# EAGLE design Io (EAGLE 6.0)
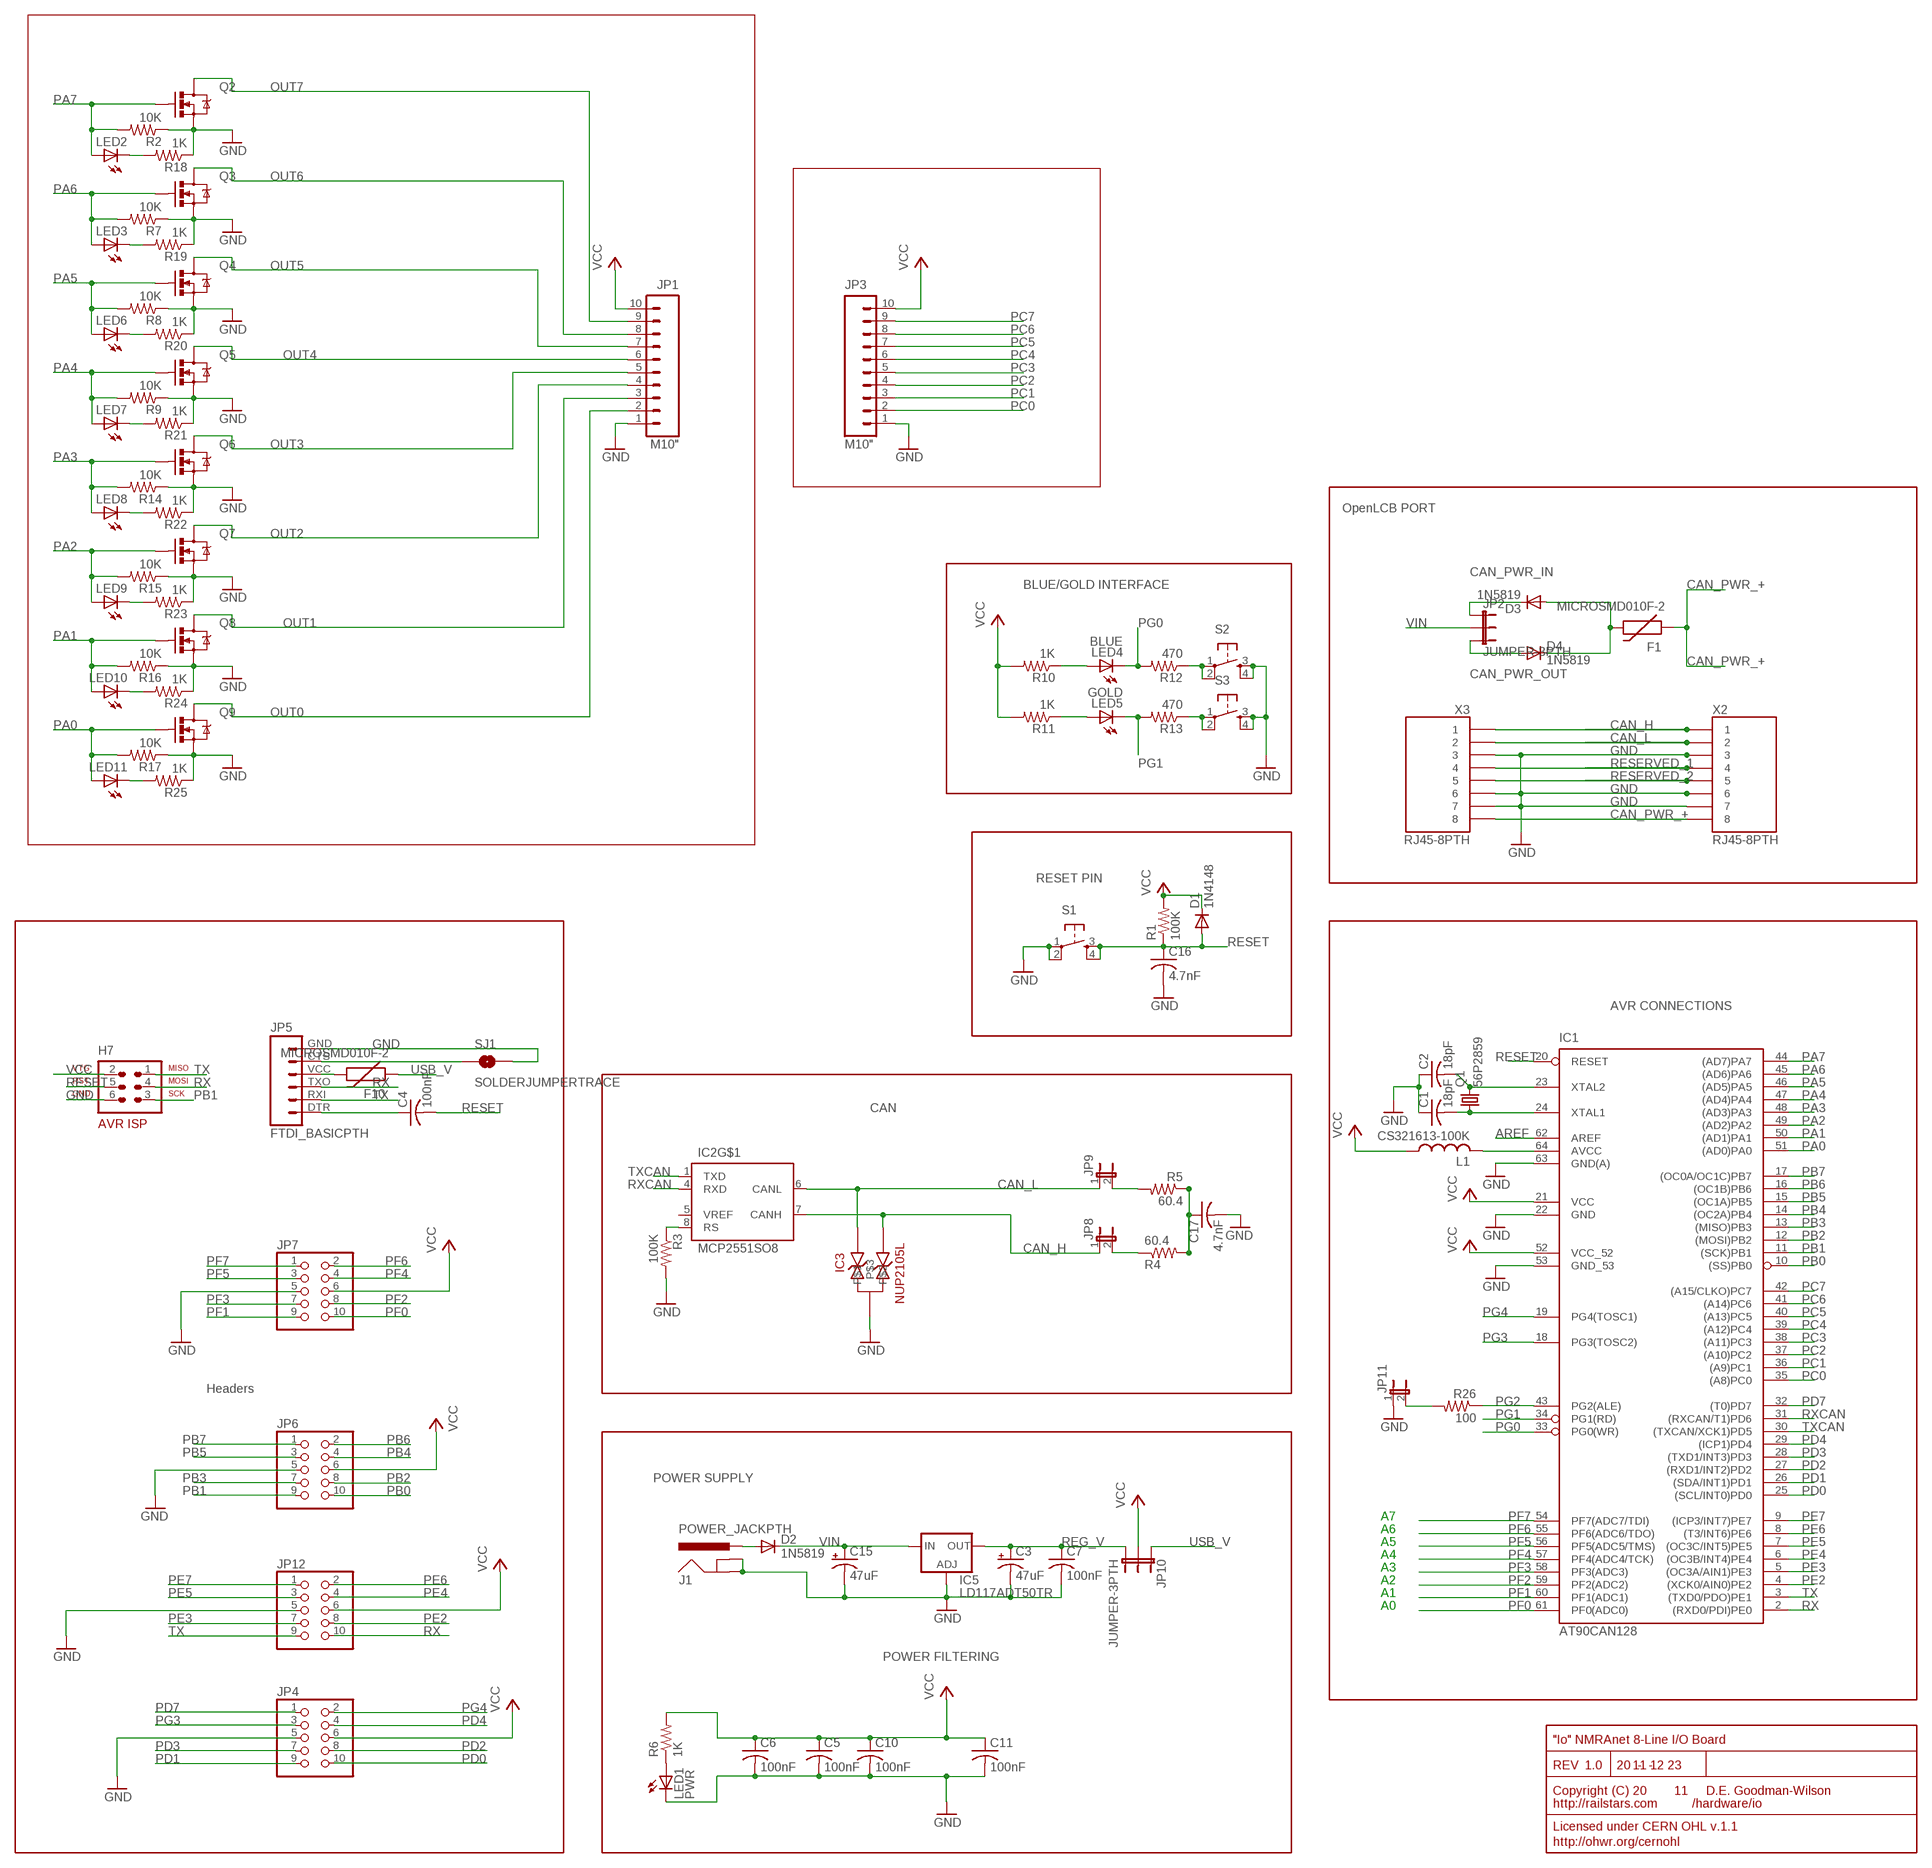
[diagram p0: schematic, sheet 1]

## Parts
C1  18pF  C-USC1206  [C1206]
C2  18pF  C-USC1206  [C1206]
C3  47uF  CPOL-USUD-6,3X5,8  [UD-6,3X5,8_NICHICON]
C4  100nF  C-USC1206  [C1206]
C5  100nF  C-USC1206  [C1206]
C6  100nF  C-USC1206  [C1206]
C7  100nF  C-USC1206  [C1206]
C10  100nF  C-USC1206  [C1206]
C11  100nF  C-USC1206  [C1206]
C15  47uF  CPOL-USUD-6,3X5,8  [UD-6,3X5,8_NICHICON]
C16  4.7nF  C-USC1206  [C1206]
C17  4.7nF  C-USC1206  [C1206]
D1  1N4148  DIODE-SOD123  [SOD123]
D2  1N5819  DIODESMA  [SMA-DIODE]
D3  1N5819  DIODESMA  [SMA-DIODE]
D4  1N5819  DIODESMA  [SMA-DIODE]
F1  MICROSMD010F-2  PTCSMD  [PTC-1206]
F10  MICROSMD010F-2  PTCSMD  [PTC-1206]
H7  ICSP  AVR-ISP-6  [AVR-ISP-6]
IC1  AT90CAN128  [TQFP64]
IC2  MCP2551SO8  [SO08]
IC3  NUP2105L  [SOT-23]
IC5  LD117ADT50TR  [DPACK]
J1  POWER_JACKPTH  [POWER_JACK_PTH]
JP1  M10"  [1X10]
JP2  JUMPER-3PTH  [1X03]
JP3  M10"  [1X10]
JP4  2X5_HEADERSHROUDED  [2X5_SHROUD]
JP5  FTDI_BASICPTH  [FTDI_BASIC]
JP6  2X5_HEADERSHROUDED  [2X5_SHROUD]
JP7  2X5_HEADERSHROUDED  [2X5_SHROUD]
JP8  JUMPER-2PTH  [1X02]
JP9  JUMPER-2PTH  [1X02]
JP10  JUMPER-3PTH  [1X03]
JP11  JUMPER-2PTH  [1X02]
JP12  2X5_HEADERSHROUDED  [2X5_SHROUD]
L1  CS321613-100K  L-USL3216C  [L3216C]
LED1  PWR  LEDCHIPLED_1206  [CHIPLED_1206]
LED2  LEDCHIPLED_1206  [CHIPLED_1206]
LED3  LEDCHIPLED_1206  [CHIPLED_1206]
LED4  BLUE  LEDCHIPLED_1206  [CHIPLED_1206]
LED5  GOLD  LEDCHIPLED_1206  [CHIPLED_1206]
LED6  LEDCHIPLED_1206  [CHIPLED_1206]
LED7  LEDCHIPLED_1206  [CHIPLED_1206]
LED8  LEDCHIPLED_1206  [CHIPLED_1206]
LED9  LEDCHIPLED_1206  [CHIPLED_1206]
LED10  LEDCHIPLED_1206  [CHIPLED_1206]
LED11  LEDCHIPLED_1206  [CHIPLED_1206]
Q1  56P2859  CRYSTALHC49S  [HC49/S]
Q2  PMV56XN  MOSFET-NCHANNELSMD  [SOT23-3]
Q3  PMV56XN  MOSFET-NCHANNELSMD  [SOT23-3]
Q4  PMV56XN  MOSFET-NCHANNELSMD  [SOT23-3]
Q5  PMV56XN  MOSFET-NCHANNELSMD  [SOT23-3]
Q6  PMV56XN  MOSFET-NCHANNELSMD  [SOT23-3]
Q7  PMV56XN  MOSFET-NCHANNELSMD  [SOT23-3]
Q8  PMV56XN  MOSFET-NCHANNELSMD  [SOT23-3]
Q9  PMV56XN  MOSFET-NCHANNELSMD  [SOT23-3]
R1  100K  R-US_R1206  [R1206]
R2  10K  R-US_R1206  [R1206]
R3  100K  R-US_R1206  [R1206]
R4  60.4  R-US_R1206  [R1206]
R5  60.4  R-US_R1206  [R1206]
R6  1K  R-US_R1206  [R1206]
R7  10K  R-US_R1206  [R1206]
R8  10K  R-US_R1206  [R1206]
R9  10K  R-US_R1206  [R1206]
R10  1K  R-US_R1206  [R1206]
R11  1K  R-US_R1206  [R1206]
R12  470  R-US_R1206  [R1206]
R13  470  R-US_R1206  [R1206]
R14  10K  R-US_R1206  [R1206]
R15  10K  R-US_R1206  [R1206]
R16  10K  R-US_R1206  [R1206]
R17  10K  R-US_R1206  [R1206]
R18  1K  R-US_R1206  [R1206]
R19  1K  R-US_R1206  [R1206]
R20  1K  R-US_R1206  [R1206]
R21  1K  R-US_R1206  [R1206]
R22  1K  R-US_R1206  [R1206]
R23  1K  R-US_R1206  [R1206]
R24  1K  R-US_R1206  [R1206]
R25  1K  R-US_R1206  [R1206]
R26  100  R-US_R1206  [R1206]
S1  TAC_SWITCHPTH  [TACTILE-PTH]
S2  TAC_SWITCHPTH  [TACTILE-PTH]
S3  TAC_SWITCHPTH  [TACTILE-PTH]
SJ1  SOLDERJUMPERTRACE  [SJ_2S-TRACE]
U$14  RAILSTARS_LOGO50MM  [RAILSTARS_50MM]
X2  RJ45-8PTH  [RJ45-8]
X3  RJ45-8PTH  [RJ45-8]

## Nets
AREF: IC1.62(AREF)
CAN_H: IC2.7(CANH) IC3.2 JP8.1 X2.1 X3.1
CAN_L: IC2.6(CANL) IC3.1 JP9.1 X2.2 X3.2
CAN_PWR_+: F1.1 X2.8 X3.8
CAN_PWR_IN: D3.C JP2.1
CAN_PWR_OUT: D4.A JP2.3
GND [gnd]: C1.1 C2.1 C3.- C5.2 C6.2 C7.2 C10.2 C11.2 C15.- C16.2 C17.2 H7.6 IC1.22(GND) IC1.53(GND_53) IC1.63(GND(A)) IC3.3 IC5.1(ADJ) J1.GND J1.GNDBREAK JP1.1 JP3.1 JP4.5 JP5.GND JP6.5 JP7.5 JP11.1 JP12.5 LED1.C Q2.2(S) Q3.2(S) Q4.2(S) Q5.2(S) Q6.2(S) Q7.2(S) Q8.2(S) Q9.2(S) R2.1 R3.2 R7.1 R8.1 R9.1 R14.1 R15.1 R16.1 R17.1 R18.1 R19.1 R20.1 R21.1 R22.1 R23.1 R24.1 R25.1 S1.1 S1.2 S2.3 S2.4 S3.3 S3.4 SJ1.2 X2.3 X2.6 X2.7 X3.3 X3.6 X3.7
N$1: C17.1 R4.2 R5.1
N$2: JP8.2 R4.1
N$3: LED4.A R10.1
N$4: JP9.2 R5.2
N$5: LED5.A R11.1
N$6: IC2.8(RS) R3.1
N$7: R12.1 S2.1 S2.2
N$8: F10.2 JP5.VCC
N$9: LED1.A R6.1
N$10: D2.A J1.PWR
N$11: C1.2 IC1.24(XTAL1) Q1.1
N$12: R13.1 S3.1 S3.2
N$13: LED10.C R24.2
N$14: LED9.C R23.2
N$15: LED8.C R22.2
N$16: D3.A D4.C F1.2
N$17: LED7.C R21.2
N$18: LED6.C R20.2
N$19: LED3.C R19.2
N$20: LED2.C R18.2
N$21: LED11.C R25.2
N$22: IC1.64(AVCC) L1.2
N$23 [gnd]: JP5.CTS SJ1.1
N$25: JP11.2 R26.2
N$35: C4.1 JP5.DTR
OUT0: JP1.2 Q9.3(D)
OUT1: JP1.3 Q8.3(D)
OUT2: JP1.4 Q7.3(D)
OUT3: JP1.5 Q6.3(D)
OUT4: JP1.6 Q5.3(D)
OUT5: JP1.7 Q4.3(D)
OUT6: JP1.8 Q3.3(D)
OUT7: JP1.9 Q2.3(D)
PA0: IC1.51((AD0)PA0) LED11.A Q9.1(G) R17.2
PA1: IC1.50((AD1)PA1) LED10.A Q8.1(G) R16.2
PA2: IC1.49((AD2)PA2) LED9.A Q7.1(G) R15.2
PA3: IC1.48((AD3)PA3) LED8.A Q6.1(G) R14.2
PA4: IC1.47((AD4)PA4) LED7.A Q5.1(G) R9.2
PA5: IC1.46((AD5)PA5) LED6.A Q4.1(G) R8.2
PA6: IC1.45((AD6)PA6) LED3.A Q3.1(G) R7.2
PA7: IC1.44((AD7)PA7) LED2.A Q2.1(G) R2.2
PB0: IC1.10((SS)PB0) JP6.10
PB1: H7.3 IC1.11((SCK)PB1) JP6.9
PB2: IC1.12((MOSI)PB2) JP6.8
PB3: IC1.13((MISO)PB3) JP6.7
PB4: IC1.14((OC2A)PB4) JP6.4
PB5: IC1.15((OC1A)PB5) JP6.3
PB6: IC1.16((OC1B)PB6) JP6.2
PB7: IC1.17((OC0A/OC1C)PB7) JP6.1
PC0: IC1.35((A8)PC0) JP3.2
PC1: IC1.36((A9)PC1) JP3.3
PC2: IC1.37((A10)PC2) JP3.4
PC3: IC1.38((A11)PC3) JP3.5
PC4: IC1.39((A12)PC4) JP3.6
PC5: IC1.40((A13)PC5) JP3.7
PC6: IC1.41((A14)PC6) JP3.8
PC7: IC1.42((A15/CLKO)PC7) JP3.9
PD0: IC1.25((SCL/INT0)PD0) JP4.10
PD1: IC1.26((SDA/INT1)PD1) JP4.9
PD2: IC1.27((RXD1/INT2)PD2) JP4.8
PD3: IC1.28((TXD1/INT3)PD3) JP4.7
PD4: IC1.29((ICP1)PD4) JP4.4
PD7: IC1.32((T0)PD7) JP4.1
PE2: IC1.4((XCK0/AIN0)PE2) JP12.8
PE3: IC1.5((OC3A/AIN1)PE3) JP12.7
PE4: IC1.6((OC3B/INT4)PE4) JP12.4
PE5: IC1.7((OC3C/INT5)PE5) JP12.3
PE6: IC1.8((T3/INT6)PE6) JP12.2
PE7: IC1.9((ICP3/INT7)PE7) JP12.1
PF0: IC1.61(PF0(ADC0)) JP7.10
PF1: IC1.60(PF1(ADC1)) JP7.9
PF2: IC1.59(PF2(ADC2)) JP7.8
PF3: IC1.58(PF3(ADC3)) JP7.7
PF4: IC1.57(PF4(ADC4/TCK)) JP7.4
PF5: IC1.56(PF5(ADC5/TMS)) JP7.3
PF6: IC1.55(PF6(ADC6/TDO)) JP7.2
PF7: IC1.54(PF7(ADC7/TDI)) JP7.1
PG0: IC1.33(PG0(WR)) LED4.C R12.2
PG1: IC1.34(PG1(RD)) LED5.C R13.2
PG2: IC1.43(PG2(ALE)) R26.1
PG3: IC1.18(PG3(TOSC2)) JP4.3
PG4: IC1.19(PG4(TOSC1)) JP4.2
REG_V: C3.+ C7.1 IC5.4(OUT) JP10.3
RESERVED_1: X2.4 X3.4
RESERVED_2: X2.5 X3.5
RESET: C4.2 C16.1 D1.A H7.5 IC1.20(RESET) R1.1 S1.3 S1.4
RX: H7.4 IC1.2((RXD0/PDI)PE0) JP5.TXO JP12.10
RXCAN: IC1.31((RXCAN/T1)PD6) IC2.4(RXD)
TX: H7.1 IC1.3((TXD0/PDO)PE1) JP5.RXI JP12.9
TXCAN: IC1.30((TXCAN/XCK1)PD5) IC2.1(TXD)
USB_V: F10.1 JP10.1
VCC: C5.1 C6.1 C10.1 C11.1 D1.C H7.2 IC1.21(VCC) IC1.52(VCC_52) JP1.10 JP3.10 JP4.6 JP6.6 JP7.6 JP10.2 JP12.6 L1.1 R1.2 R6.2 R10.2 R11.2
VIN: C15.+ D2.C IC5.3(IN) JP2.2
XTAL1: C2.2 IC1.23(XTAL2) Q1.2
Unconnected: IC2.5(VREF)

## Notes on the sheet
- OpenLCB PORT
- BLUE/GOLD INTERFACE
- RESET PIN
- AVR CONNECTIONS
- CAN
- Headers
- POWER SUPPLY
- A7
- A6
- A5
- A4
- A3
- A2
- A1
- A0
- POWER FILTERING
- "Io" NMRAnet 8-Line I/O Board
- 1.0 | 11 12 23
- 11
- /hardware/io
- Licensed under CERN OHL v.1.1
- http://ohwr.org/cernohl

## Power pins joined to a net without a drawn wire
GND: IC2.2(GND)
VCC: IC2.3(VCC)

## Library data of the parts
C1 C2 C4-C7 C10 C11 C16 C17 = rcl:C-US: CAPACITOR, American symbol
C3 C15 = rcl:CPOL-US: POLARIZED CAPACITOR, American symbol
D1 = diode:DIODE-: DIODE
D2-D4 = SparkFun:DIODE: Diode These are standard reverse protection diodes and small signal diodes. SMA package can handle up to about 1A. SOD-323 can handle about 200mA. What the SOD-323 package when ordering, there are some mfgs out there that are 5-pin packages.
F1 F10 = SparkFun:PTC: Resettable Fuse PTC Resettable Fuse. Spark Fun Electronics SKU : COM-08357
H7 = avr-4:AVR-ISP-6: AVR ISP-6 Serial Programming Header
IC1 = at90can128:AT90CAN128
IC2 = can:MCP2551: CAN Tranceiver Microchip
IC3 = Artificial Science:NUP2105L
IC5 = v-reg:LD117A?*: Low drop fixed and adjustable positive voltage regulators 1 A Source: http://www.st.com/stonline/products/literature/ds/7194/ld1117axx.pdf
J1 = SparkFun:POWER_JACK: Power Jack This is the standard 5.5mm barrel jack for power. The PTH is the most common, proven, reliable, footprint. All others are experimental. The Slot footprint only works if the mill layer is transmitted to the PCB fab house so be warned. Spark Fun Electronics SKU : PRT-00119. Mating wall wart : TOL-00298 (and others)
JP1 JP3 = SparkFun:M10: Header 10 Standard 10-pin 0.1" header. Use with straight break away headers (SKU : PRT-00116), right angle break away headers (PRT-00553), swiss pins (PRT-00743), machine pins (PRT-00117), and female headers (PRT-00115).
JP2 JP10 = SparkFun:JUMPER-3
JP4 JP6 JP7 JP12 = Railstars:2X5_HEADER
JP5 = SparkFun:FTDI_BASIC: FTDI Basic: 3.3V and 5V
JP8 JP9 JP11 = SparkFun:JUMPER-2: Jumper Basic 0.1" spaced jumper. Use with breakaway headers.
L1 = rcl:L-US: INDUCTOR, American symbol
LED1-LED11 = led:LED: LED OSRAM: - CHIPLED LG R971, LG N971, LY N971, LG Q971, LY Q971, LO R971, LY R971 LH N974, LH R974 LS Q976, LO Q976, LY Q976 LO Q996 - Hyper CHIPLED LW Q18S LB Q993, LB Q99A, LB R99A - SideLED LS A670, LO A670, LY A670, LG A670, LP A670 LB A673, LV A673, LT A673, LW A673 LH A674 LY A675 LS A676, LA A676, LO A676, LY A676, LW A676 LS A679, LY A679, LG A679 - Hyper Micro SIDELED® LS Y876, LA Y876, LO Y876, LY Y876 LT Y87S - SmartLED LW L88C, LW L88S LB L89C, LB L89S, LG L890 LS L89K, LO L89K, LY L89K LS L896, LA L896, LO L896, LY L896 - TOPLED LS T670, LO T670, LY T670, LG T670, LP T670 LSG T670, LSP T670, LSY T670, LOP T670, LYG T670 LG T671, LOG T671, LSG T671 LB T673, LV T673, LT T673, LW T673 LH T674 LS T676, LA T676, LO T676, LY T676, LB T676, LH T676, LSB T676, LW T676 LB T67C, LV T67C, LT T67C, LS T67K, LO T67K, LY T67K, LW E67C LS E67B, LA E67B, LO E67B, LY E67B, LB E67C, LV E67C, LT E67C LW T67C LS T679, LY T679, LG T679 LS T770, LO T770, LY T770, LG T770, LP T770 LB T773, LV T773, LT T773, LW T773 LH T774 LS E675, LA E675, LY E675, LS T675 LS T776, LA T776, LO T776, LY T776, LB T776 LHGB T686 LT T68C, LB T68C - Hyper Mini TOPLED® LB M676 - Mini TOPLED Santana® LG M470 LS M47K, LO M47K, LY M47K Source: http://www.osram.convergy.de LUXEON: - LUMILED® LXK2-PW12-R00, LXK2-PW12-S00, LXK2-PW14-U00, LXK2-PW14-V00 LXK2-PM12-R00, LXK2-PM12-S00, LXK2-PM14-U00 LXK2-PE12-Q00, LXK2-PE12-R00, LXK2-PE12-S00, LXK2-PE14-T00, LXK2-PE14-U00 LXK2-PB12-K00, LXK2-PB12-L00, LXK2-PB12-M00, LXK2-PB14-N00, LXK2-PB14-P00, LXK2-PB14-Q00 LXK2-PR12-L00, LXK2-PR12-M00, LXK2-PR14-Q00, LXK2-PR14-R00 LXK2-PD12-Q00, LXK2-PD12-R00, LXK2-PD12-S00 LXK2-PH12-R00, LXK2-PH12-S00 LXK2-PL12-P00, LXK2-PL12-Q00, LXK2-PL12-R00 Source: www.luxeon.com KINGBRIGHT: KA-3528ASYC Source: www.kingbright.com
Q1 = crystal:CRYSTAL: CRYSTAL; OC_FARNELL: 1667008; OC_NEWARK: unknown
Q2-Q9 = SparkFun:MOSFET-NCHANNEL
R1-R26 = rcl:R-US_: RESISTOR, American symbol
S1-S3 = SparkFun:TAC_SWITCH: Momentary Switch Button commonly used for reset or general input. Spark Fun Electronics SKU : COM-00097
SJ1 = SparkFun:SOLDERJUMPER: Solder Jumper Standard SMD solder jumper. Used to automate production. Two varients : Normally Open and Normally Closed are the same, but have different paste layers. NC will have a large amount of paste and should jumper during reflow.
U$14 = Artificial Science:RAILSTARS_LOGO
X2 X3 = SparkFun:RJ45-8: RJ45 Jack Simple RJ45, 8-pin connection - connector for common Cat5, Cat5e, and Cat6 Ethernet cables. Footprint not yet proven in production. Connector sku is PRT-00643; Breakout PCB sku is BOB-00716.

## Net classes
0 default: width 0.254 mm, drill 0.305 mm, clearance 0.152 mm
2 gnd: width 0.305 mm, drill 0.508 mm, clearance 0.152 mm
3 usbvcc: width 0.508 mm, drill 0.508 mm, clearance 0.152 mm

## Board
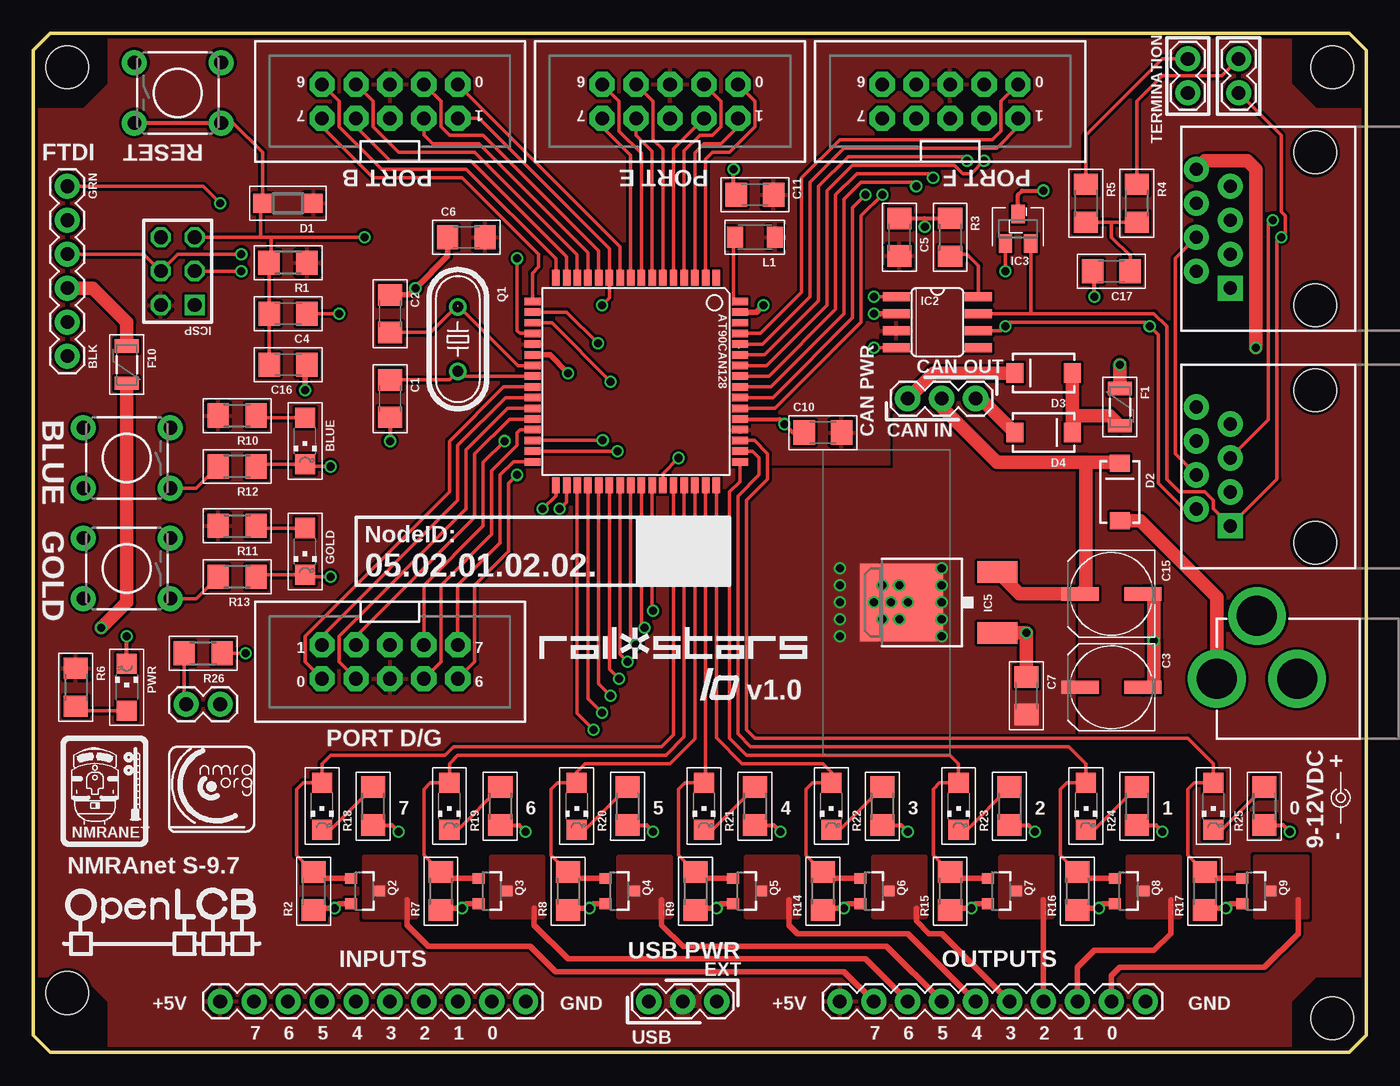
[diagram p1: board, top side]
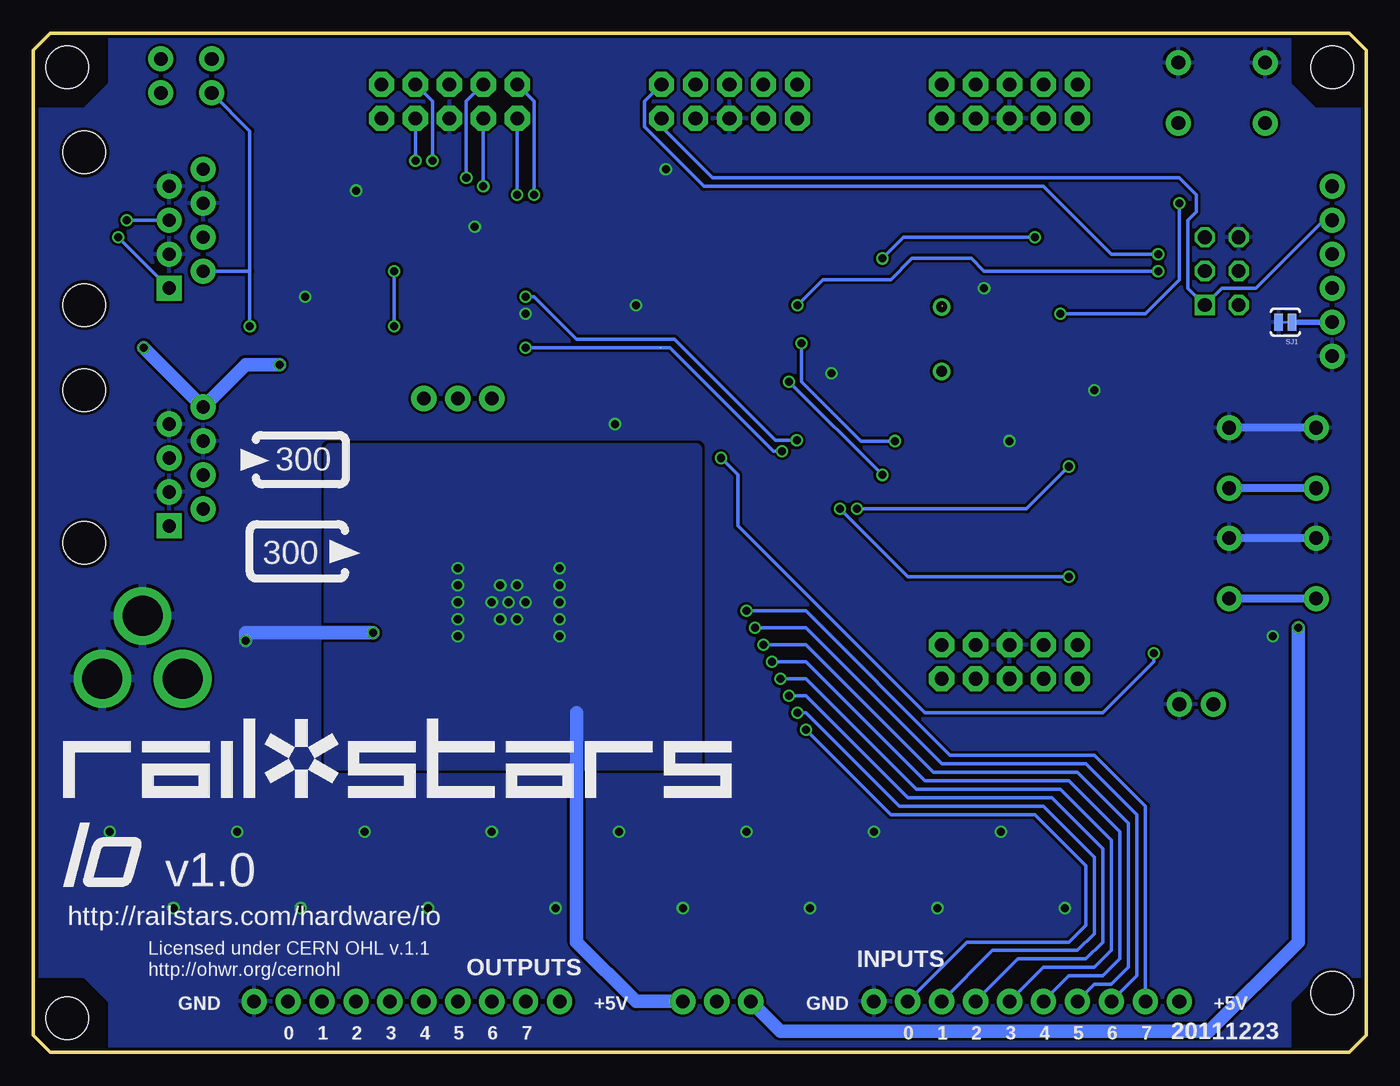
[diagram p2: board, bottom side, seen from below]

Size 99.69 x 76.2 mm. Coordinates in mm from the lower left corner, seen from the top.
Outline: 99.69,1.27 98.42,0 1.27,0 0,1.27 0,74.93 1.27,76.2 98.42,76.2 99.69,74.93 99.69,1.27
Copper layers (1*16): Top 0.035mm / dielectric 1.5mm / Bottom 0.035mm
Design rules: minimum track width 8mil, minimum drill 12mil, track to track 8mil, track to pad 8mil, pad to pad 8mil, via to via 8mil, smd to smd 0mil, copper to edge 10mil, drill to drill 10mil, minimum pad ring 10mil, minimum via ring 6mil, stop-mask expansion 2mil, vias tented up to drill 100mil, thermal gap 10mil
Holes 3.2 mm at 97.16,2.54 97.16,73.66 2.54,73.66 2.54,4.45

### Footprints (pad centres in the part's own frame; a part is rotated, then mirrored left to right if it is on the bottom)
C1206 = smd 1.6 x 1.8: 1 -1.4,0; 2 1.4,0
UD-6,3X5,8_NICHICON = smd 2.8 x 1: + 2.35,0; - -2.35,0
SOD123 = smd 1.4 x 1.4: A 1.9,0; C -1.9,0
SMA-DIODE = smd 1.27 x 1.47: A -2.15,0; C 2.15,0
PTC-1206 = smd 1 x 1.8: 1 -1.4,0; 2 1.4,0
AVR-ISP-6 = drill 1.016 square: 1 -2.54,-1.27 | drill 1.016 octagon: 2 -2.54,1.27; 3 0,-1.27; 4 0,1.27; 5 2.54,-1.27; 6 2.54,1.27
TQFP64 = smd 1.194 x 0.559: 1 -7.76,6; 2 -7.76,5.2; 3 -7.76,4.4; 4 -7.76,3.6; 5 -7.76,2.8; 6 -7.76,2; 7 -7.76,1.2; 8 -7.76,0.4; 9 -7.76,-0.4; 10 -7.76,-1.2; 11 -7.76,-2; 12 -7.76,-2.8; 13 -7.76,-3.6; 14 -7.76,-4.4; 15 -7.76,-5.2; 16 -7.76,-6; 33 7.76,-6; 34 7.76,-5.2; 35 7.76,-4.4; 36 7.76,-3.6; 37 7.76,-2.8; 38 7.76,-2; 39 7.76,-1.2; 40 7.76,-0.4; 41 7.76,0.4; 42 7.76,1.2; 43 7.76,2; 44 7.76,2.8; 45 7.76,3.6; 46 7.76,4.4; 47 7.76,5.2; 48 7.76,6 | smd 0.559 x 1.194: 17 -6,-7.76; 18 -5.2,-7.76; 19 -4.4,-7.76; 20 -3.6,-7.76; 21 -2.8,-7.76; 22 -2,-7.76; 23 -1.2,-7.76; 24 -0.4,-7.76; 25 0.4,-7.76; 26 1.2,-7.76; 27 2,-7.76; 28 2.8,-7.76; 29 3.6,-7.76; 30 4.4,-7.76; 31 5.2,-7.76; 32 6,-7.76; 49 6,7.76; 50 5.2,7.76; 51 4.4,7.76; 52 3.6,7.76; 53 2.8,7.76; 54 2,7.76; 55 1.2,7.76; 56 0.4,7.76; 57 -0.4,7.76; 58 -1.2,7.76; 59 -2,7.76; 60 -2.8,7.76; 61 -3.6,7.76; 62 -4.4,7.76; 63 -5.2,7.76; 64 -6,7.76
SO08 = smd 0.66 x 2.032: 1 -1.905,-3.073; 2 -0.635,-3.073; 3 0.635,-3.073; 4 1.905,-3.073; 5 1.905,3.073; 6 0.635,3.073; 7 -0.635,3.073; 8 -1.905,3.073
SOT-23 = smd 1 x 1.4: 1 -0.95,-1.1; 2 0.95,-1.1; 3 0,1.1
DPACK = smd 1.6 x 3: 1 -2.28,-4.8; 3 2.28,-4.8 | smd 5.8 x 6.2: 4 0,2.38
POWER_JACK_PTH = drill 2.997 pad 4.318: GND 0,7.7; GNDBREAK 4.7,10.7; PWR 0,13.7
1X10 = drill 1.016 pad 1.88: 1 0,0; 2 2.54,0; 3 5.08,0; 4 7.62,0; 5 10.16,0; 6 12.7,0; 7 15.24,0; 8 17.78,0; 9 20.32,0; 10 22.86,0
1X03 = drill 1.016 pad 1.88: 1 0,0; 2 2.54,0; 3 5.08,0
2X5_SHROUD = drill 1.016 pad 1.88 octagon: 1 -1.27,5.08; 2 1.27,5.08; 3 -1.27,2.54; 4 1.27,2.54; 5 -1.27,0; 6 1.27,0; 7 -1.27,-2.54; 8 1.27,-2.54; 9 -1.27,-5.08; 10 1.27,-5.08
FTDI_BASIC = drill 1.016 pad 1.88: CTS 10.16,0; DTR 0,0; GND 12.7,0; RXI 2.54,0; TXO 5.08,0; VCC 7.62,0
1X02 = drill 1.016 pad 1.88: 1 0,0; 2 2.54,0
L3216C = smd 1.2 x 1.6: 1 -1.5,0; 2 1.5,0
CHIPLED_1206 = smd 1.5 x 1.5: A 0,-1.75; C 0,1.75
HC49/S = drill 0.813: 1 -2.413,0; 2 2.413,0
SOT23-3 = smd 0.8 x 0.9: 1 -0.95,-1; 2 0.95,-1; 3 0,1.1
R1206 = smd 1.6 x 1.803: 1 -1.422,0; 2 1.422,0
TACTILE-PTH = drill 1.016 pad 1.88: 1 -3.251,2.261; 2 3.251,2.261; 3 -3.251,-2.261; 4 3.251,-2.261
SJ_2S-TRACE = smd 0.635 x 1.27: 1 -0.508,0; 2 0.508,0
RJ45-8 = drill 1 pad 1.88 square: 1 -4.445,6.35 | drill 1 pad 1.88: 2 -3.175,8.89; 3 -1.905,6.35; 4 -0.635,8.89; 5 0.635,6.35; 6 1.905,8.89; 7 3.175,6.35; 8 4.445,8.89 | hole 3.2: -5.715,0; 5.715,0

### Placement (x,y rotation side)
C1  26.67,48.9 90 top
C2  26.67,55.24 270 top
C3  80.64,27.3 180 top
C4  19.05,55.24 180 top
C5  64.77,60.96 90 top
C6  32.38,60.96 180 top
C7  74.3,26.67 90 top
C10  59.05,46.35 180 top
C11  53.98,64.14 180 top
C15  80.64,34.29 180 top
C16  19.05,51.44 0 top
C17  80.64,58.42 180 top
D1  19.05,63.5 180 top
D2  81.28,41.91 90 top
D3  75.56,50.8 180 top
D4  75.56,46.35 0 top
F1  81.28,48.26 270 top
F10  6.99,51.44 90 top
H7  10.79,58.42 90 top
IC1  45.09,50.16 270 top
IC2  67.63,54.61 270 top
IC3  73.66,61.59 0 top
IC5  67.31,33.66 90 top
J1  102.23,27.94 90 top
JP1  83.19,3.81 180 top
JP2  65.41,48.9 0 top
JP3  36.83,3.81 180 top
JP4  26.67,29.21 270 top
JP5  2.54,64.77 270 top
JP6  26.67,71.12 90 top
JP7  68.58,71.12 90 top
JP8  90.17,71.75 90 top
JP9  86.36,71.75 90 top
JP10  46.04,3.81 0 top
JP11  13.97,26.04 180 top
JP12  47.62,71.12 90 top
L1  53.98,60.96 180 top
LED1  6.99,27.3 0 top
LED2  21.59,18.41 180 top
LED3  31.11,18.41 180 top
LED4  20.32,45.72 180 top
LED5  20.32,37.47 180 top
LED6  40.64,18.41 180 top
LED7  50.16,18.41 180 top
LED8  59.69,18.41 180 top
LED9  69.22,18.41 180 top
LED10  78.74,18.41 180 top
LED11  88.27,18.41 180 top
Q1  31.75,53.34 90 top
Q2  24.77,12.06 270 top
Q3  34.29,12.06 270 top
Q4  43.81,12.06 270 top
Q5  53.34,12.06 270 top
Q6  62.87,12.06 270 top
Q7  72.39,12.06 270 top
Q8  81.92,12.06 270 top
Q9  91.44,12.06 270 top
R1  19.05,59.05 0 top
R2  20.95,12.06 90 top
R3  68.58,60.96 90 top
R4  82.55,63.5 270 top
R5  78.74,63.5 90 top
R6  3.17,27.3 90 top
R7  30.48,12.06 90 top
R8  40.01,12.06 90 top
R9  49.53,12.06 90 top
R10  15.24,47.62 180 top
R11  15.24,39.37 180 top
R12  15.24,43.81 0 top
R13  15.24,35.56 0 top
R14  59.05,12.06 90 top
R15  68.58,12.06 90 top
R16  78.11,12.06 90 top
R17  87.63,12.06 90 top
R18  25.4,18.41 90 top
R19  34.92,18.41 90 top
R20  44.45,18.41 90 top
R21  53.98,18.41 90 top
R22  63.5,18.41 90 top
R23  73.03,18.41 90 top
R24  82.55,18.41 90 top
R25  92.08,18.41 90 top
R26  12.7,29.84 180 top
S1  10.79,71.75 0 top
S2  6.99,44.45 180 top
S3  6.99,36.2 180 top
SJ1  6.03,54.61 180 bottom
U$1  [RAILSTARS_1IN]  37.47,29.21 0 top
U$2  [CURRENT_DRAWV]  84.45,42.23 0 bottom
U$3  [CURRENT_PROVIDEV]  83.5,34.92 0 bottom
U$4  [NMRANET_LOGO_MED]  1.91,15.24 0 top
U$5  [LOGO_IO_V]  49.85,26.35 0 top
U$6  [LOGO_IO_LARGE_V]  97.47,12.38 0 bottom
U$9  [OPENLCB_LOGOV]  1.91,6.99 0 top
U$10  [NMRA_ORG_SMALL]  10.16,16.51 0 top
U$14  97.47,19.05 0 bottom
X2  95.89,61.59 90 top
X3  95.89,43.81 90 top

### Tracks (layer width: path | path; a pad name or v marks a point on that pad's centre or on a via)
CAN_H  (via drill 0.6)
  Top 0.254: 89.85,71.75 JP8.1 93.34,68.58 93.34,62.87 93.66,62.55 93.66,61.28 v93.34,60.96 93.03,60.64 93.03,42.86 X3.1 88.27,40.64 88.27,41.27 87.63,41.91 85.72,41.91 84.77,42.86 84.77,54.29 83.82,55.24 74.61,55.24 | 74.61,55.24 IC2.7 70.48,55.24 | IC3.2 74.61,55.25 74.61,55.24
  Bottom 0.254: v93.34,60.96 X2.1
CAN_L  (via drill 0.6)
  Top 0.254: X3.2 86.04,40.64 84.14,42.55 84.14,53.66 v83.5,54.29 83.19,54.61 73.03,54.61 v72.71,54.29 72.39,53.98 IC2.6 | IC3.1 v72.71,58.42
  Bottom 0.254: v83.5,54.29 83.5,58.42 | 83.5,58.42 83.5,68.9 JP9.1 | X2.2 83.5,58.42 | v72.71,58.42 v72.71,54.29
CAN_PWR_+  (via drill 0.6)
  Top 1.016: F1.1 v81.28,51.44 | v91.44,52.7 91.44,66.04 90.81,66.67 87.63,66.67 X2.8
  Bottom 1.016: v81.28,51.44 83.82,51.44 X3.8 v91.44,52.7
CAN_PWR_IN
  Top 1.016: D3.C 67.31,50.8 JP2.1
CAN_PWR_OUT
  Top 1.016: JP2.3 70.88,48.9 D4.A
GND  (via drill 0.6)
  Top 0.305: LED1.C v6.99,31.11 | 20.32,51.3 C16.2 | C1.1 v26.67,45.72 | IC3.3 73.66,63.5 73.66,64.14 73.98,64.45 v75.56,64.45 | C17.2 79.38,58.42 v79.38,56.52 | 66.67,62.38 v66.67,61.75 | 66.67,62.38 R3.2 | 66.67,62.38 64.77,62.38 C5.2 | C11.2 52.39,64.14 v52.39,66.04 | R18.1 26.82,16.99 v27.3,16.51 | R19.1 36.35,16.99 v36.83,16.51 | R20.1 45.87,16.99 v46.35,16.51 | R21.1 55.4,16.99 v55.88,16.51 | R22.1 64.92,16.99 v65.41,16.51 | R23.1 74.45,16.99 v74.93,16.51 | R24.1 83.97,16.99 v84.45,16.51 | R25.1 93.5,16.99 v93.98,16.51 | IC1.53 55.82,47.37 v56.2,46.99 56.83,46.35 C10.2
  Top 0.406: IC1.22 38.64,52.16 v40.01,50.8 | IC2.2 v62.87,55.24 | IC1.63 54.09,55.37 v54.61,55.88 | v20.32,49.53 20.32,51.3 | Q2.2 22.86,11.12 v22.54,10.79 21.11,10.79 R2.1 | Q3.2 32.39,11.12 v32.07,10.79 30.63,10.79 R7.1 | Q4.2 41.91,11.12 v41.59,10.79 40.16,10.79 R8.1 | Q5.2 51.44,11.12 v51.12,10.79 49.68,10.79 R9.1 | Q6.2 60.96,11.12 v60.64,10.79 59.21,10.79 R14.1 | Q7.2 70.49,11.12 v70.17,10.79 68.73,10.79 R15.1 | Q8.2 80.01,11.12 v79.69,10.79 78.26,10.79 R16.1 | Q9.2 89.54,11.12 v89.22,10.79 87.78,10.79 R17.1 | C6.2 30.98,59.56 v28.57,57.15 28.07,56.65 C2.1
  Top 1.016: C15.- 83.82,34.29 v83.82,30.8 83.82,27.3 C3.- | IC5.1 v74.3,31.38 C7.2
  Bottom 0.61: S2.4 S2.3 | S3.4 S3.3
  Bottom 1.016: v74.3,31.38 83.82,31.38 v83.82,30.8
  pour Bottom (rank 6): 5.71,72.39 5.71,76.2 93.98,76.2 93.98,72.39 95.89,70.48 99.69,70.48 99.69,5.71 95.89,5.71 93.98,3.81 93.98,0 5.71,0 5.71,3.81 3.81,5.71 0,5.71 0,70.48 3.81,70.48
  pour Bottom: 88.9,36.2 98.42,36.2 98.42,24.13 90.81,24.13 90.81,26.67 90.81,29.84 88.27,29.84 88.27,36.2
N$1
  Top 0.254: C17.1 82.05,59.56 80.64,60.96 80.64,62.08 | 80.64,62.08 R4.2 | 80.64,62.08 R5.1
N$2
  Top 0.254: JP8.2 88.9,73.03 84.45,73.03 82.55,71.12 R4.1
N$3
  Top 0.254: 19.99,47.47 LED4.A 16.82,47.47 R10.1
N$4
  Top 0.254: JP9.2 84.45,74.3 78.74,68.58 R5.2
N$5
  Top 0.254: R11.1 16.82,39.22 LED5.A
N$6
  Top 0.254: IC2.8 70.7,58.84 69.85,59.69 68.73,59.69 R3.1
N$7
  Top 0.254: R12.1 12.19,42.19 S2.1
  Bottom 0.61: S2.2 S2.1
N$8
  Top 1.016: JP5.VCC 4.45,57.15 6.99,54.61 F10.2
N$9
  Top 0.254: R6.1 3.5,25.55 LED1.A
N$10
  Top 1.016: J1.PWR 88.53,34.02 82.8,39.76 D2.A
N$11
  Top 0.254: C1.2 31.12,50.3 Q1.1 32.11,50.56 IC1.24
N$12
  Top 0.254: S3.1 12.19,33.93 R13.1
  Bottom 0.61: S3.2 S3.1
N$13
  Top 0.254: LED10.C 79.38,16.66 R24.2
N$14
  Top 0.254: LED9.C 69.85,16.66 R23.2
N$15
  Top 0.254: LED8.C 60.33,16.66 R22.2
N$16
  Top 1.016: F1.2 80.52,47.62 77.79,47.62 77.72,47.55 D4.C D3.A
N$17
  Top 0.254: LED7.C 50.8,16.66 R21.2
N$18
  Top 0.254: LED6.C 41.28,16.66 R20.2
N$19
  Top 0.254: LED3.C 31.75,16.66 R19.2
N$20
  Top 0.254: LED2.C 22.23,16.66 R18.2
N$21
  Top 0.254: LED11.C 88.9,16.66 R25.2
N$22
  Top 0.254: IC1.64 52.42,56.16 52.39,56.2 52.39,60.96 L1.2
  Top 0.305: IC1.64 52.7,56.3
N$23
  Bottom 0.406: SJ1.1 JP5.CTS
N$25
  Top 0.254: R26.2 11.28,26.19 JP11.2
N$35  (via drill 0.6)
  Top 0.254: JP5.DTR 12.7,64.77 v13.97,63.5 | v22.86,55.24 C4.1
  Bottom 0.254: v13.97,63.5 13.97,57.78 16.51,55.24 v22.86,55.24
OUT0
  Top 0.406: JP1.2 80.64,5.71 81.28,6.35 92.08,6.35 94.61,8.89 94.61,11.43
  pour Top (no thermals): 91.44,10.16 95.25,10.16 95.25,14.61 91.44,14.61
OUT1
  Top 0.406: JP1.3 78.11,6.35 79.38,7.62 83.82,7.62 85.09,8.89 85.09,11.43
  pour Top (no thermals): 81.92,10.16 85.72,10.16 85.72,14.61 81.92,14.61
OUT2
  Top 0.406: JP1.4 75.56,11.43
  pour Top (no thermals): 72.39,10.16 76.2,10.16 76.2,14.61 72.39,14.61
OUT3
  Top 0.406: JP1.5 67.94,8.89 66.99,8.89 66.04,9.84 66.04,10.79
  pour Top (no thermals): 62.87,10.16 66.67,10.16 66.67,14.61 62.87,14.61
OUT4
  Top 0.406: JP1.6 65.41,8.89 57.15,8.89 56.52,9.53 56.52,11.43
  pour Top (no thermals): 53.34,10.16 57.15,10.16 57.15,14.61 53.34,14.61
OUT5
  Top 0.406: JP1.7 63.82,7.94 48.58,7.94 46.99,9.53 46.99,11.43
  pour Top (no thermals): 43.81,10.16 47.62,10.16 47.62,14.61 43.81,14.61
OUT6
  Top 0.406: JP1.8 62.23,6.99 40.01,6.99 37.47,9.53 37.47,10.79
  pour Top (no thermals): 34.29,10.16 38.1,10.16 38.1,14.61 34.29,14.61
OUT7
  Top 0.406: JP1.9 60.64,6.03 39.05,6.03 37.15,7.94 29.53,7.94 27.94,9.53 27.94,11.43
  pour Top (no thermals): 24.77,10.16 28.57,10.16 28.57,14.61 24.77,14.61
PA0
  Top 0.254: IC1.51 53.93,45.77 54.93,44.77 54.93,42.86 53.34,41.27 53.34,24.13 53.98,23.5 86.36,23.5 88.27,21.59 LED11.A 86.84,20.16 86.36,19.68 86.36,14.76 R17.2
  Top 0.406: Q9.1 88.1,13.02 R17.2
PA1
  Top 0.254: IC1.50 53.78,44.97 54.29,44.45 54.29,43.18 52.7,41.59 52.7,23.81 53.66,22.86 77.47,22.86 78.74,21.59 LED10.A 77.31,20.16 76.83,19.68 76.83,14.76 R16.2
  Top 0.406: Q8.1 78.58,13.02 R16.2
PA2
  Top 0.254: IC1.49 52.84,42.69 52.07,41.91 52.07,23.5 53.34,22.23 68.58,22.23 69.22,21.59 LED9.A 67.79,20.16 67.31,19.68 67.31,14.76 R15.2
  Top 0.406: Q7.1 69.05,13.02 R15.2
PA3
  Top 0.254: IC1.48 51.09,23.53 53.02,21.59 59.05,21.59 59.69,20.95 LED8.A 58.27,20.16 57.78,19.68 57.78,14.76 R14.2
  Top 0.406: Q6.1 59.53,13.02 R14.2
PA4
  Top 0.254: R9.2 48.26,14.76 48.26,19.68 48.74,20.16 LED7.A 50.28,20.29 IC1.47
  Top 0.406: Q5.1 50,13.02 R9.2
PA5
  Top 0.254: IC1.46 49.48,23.45 47.62,21.59 41.27,21.59 40.64,20.95 LED6.A 39.22,20.16 38.73,19.68 38.73,14.76 R8.2
  Top 0.406: Q4.1 40.48,13.02 R8.2
PA6
  Top 0.254: IC1.45 48.69,23.6 47.31,22.23 31.75,22.23 31.11,21.59 LED3.A 29.69,20.16 29.21,19.68 29.21,14.76 R7.2
  Top 0.406: Q3.1 30.95,13.02 R7.2
PA7
  Top 0.254: IC1.44 47.88,23.75 46.99,22.86 31.43,22.86 30.8,22.23 22.23,22.23 21.59,21.59 LED2.A 20.16,20.16 19.68,19.68 19.68,14.76 R2.2
  Top 0.406: Q2.1 21.43,13.02 R2.2
PB0
  Top 0.254: IC1.10 43.88,60.26 JP6.10
PB1  (via drill 0.6)
  Top 0.254: v42.55,55.88 43.09,56.42 IC1.11 43.09,60.1 33.34,69.85 JP6.9 | H7.3 v15.56,58.42
  Bottom 0.254: v15.56,58.42 28.57,58.42 29.53,59.37 33.97,59.37 35.56,57.78 40.64,57.78 v42.55,55.88
PB2
  Top 0.254: IC1.12 42.28,59.95 33.66,68.58 31.11,68.58 30.48,69.22 30.48,71.12 JP6.8
PB3
  Top 0.254: IC1.13 41.48,59.8 33.34,67.94 29.84,67.94 29.21,68.58 JP6.7
PB4
  Top 0.254: IC1.14 40.69,59.65 33.02,67.31 27.3,67.31 25.4,69.22 25.4,71.12 JP6.4
PB5
  Top 0.254: IC1.15 39.88,59.49 32.7,66.67 26.67,66.67 24.13,69.22 JP6.3
PB6
  Top 0.254: IC1.16 39.09,59.34 32.38,66.04 26.04,66.04 22.86,69.22 22.86,71.12 JP6.2
PB7
  Top 0.254: IC1.17 37.33,58.28 37.78,58.74 37.78,59.69 32.07,65.41 25.4,65.41 21.59,69.22 JP6.1
PC0  (via drill 0.6)
  Top 0.254: IC1.35 40.69,25.36 v41.91,24.13
  Bottom 0.254: JP3.2 29.84,8.26 22.23,8.26 20.95,9.53 20.95,13.97 24.77,17.78 35.56,17.78 v41.91,24.13
PC1  (via drill 0.6)
  Top 0.254: IC1.36 41.48,26.46 v42.55,25.4
  Bottom 0.254: JP3.3 27.94,7.62 21.59,7.62 20.32,8.89 20.32,14.61 24.13,18.41 34.92,18.41 41.91,25.4 v42.55,25.4
PC2  (via drill 0.6)
  Top 0.254: IC1.37 42.28,27.57 v43.18,26.67
  Bottom 0.254: v43.18,26.67 41.91,26.67 34.29,19.05 23.5,19.05 19.68,15.24 19.68,8.26 20.95,6.99 26.04,6.99 JP3.4
PC3  (via drill 0.6)
  Top 0.254: IC1.38 43.09,28.67 v43.81,27.94
  Bottom 0.254: v43.81,27.94 41.91,27.94 33.66,19.68 22.86,19.68 19.05,15.88 19.05,7.62 20.32,6.35 24.13,6.35 JP3.5
PC4  (via drill 0.6)
  Top 0.254: IC1.39 43.88,29.77 v44.45,29.21
  Bottom 0.254: JP3.6 22.23,5.71 19.68,5.71 18.41,6.99 18.41,16.51 22.23,20.32 33.02,20.32 41.91,29.21 v44.45,29.21
PC5  (via drill 0.6)
  Top 0.254: IC1.40 44.69,30.88 v45.09,30.48
  Bottom 0.254: JP3.7 20.32,5.08 19.05,5.08 17.78,6.35 17.78,17.14 21.59,20.95 32.38,20.95 41.91,30.48 v45.09,30.48
PC6  (via drill 0.6)
  Top 0.254: IC1.41 45.48,31.98 v45.72,31.75
  Bottom 0.254: JP3.8 17.14,5.71 17.14,17.78 20.95,21.59 31.75,21.59 41.91,31.75 v45.72,31.75
PC7  (via drill 0.6)
  Top 0.254: IC1.42 46.28,33.09 v46.35,33.02
  Bottom 0.254: JP3.9 16.51,18.41 20.32,22.23 31.11,22.23 41.91,33.02 v46.35,33.02
PD0
  Top 0.254: IC1.25 35.16,49.77 31.11,45.72 31.11,41.91 20.32,31.11 20.32,29.21 JP4.10
PD1
  Top 0.254: IC1.26 35.31,48.97 31.75,45.4 31.75,41.27 21.59,31.11 JP4.9
PD2
  Top 0.254: IC1.27 35.47,48.16 32.38,45.09 32.38,40.64 22.86,31.11 22.86,29.21 JP4.8
PD3
  Top 0.254: IC1.28 35.62,47.37 33.02,44.77 33.02,40.01 24.13,31.11 JP4.7
PD4
  Top 0.254: IC1.29 36.41,46.56 36.2,46.35 36.2,45.4 34.29,43.5 34.29,38.73 30.48,34.92 30.48,29.21 JP4.4
PD7
  Top 0.254: JP4.1 31.75,34.92 34.92,38.1 34.92,43.18 35.91,44.16 IC1.32
PE2
  Top 0.254: JP12.8 51.44,71.12 51.44,69.22 50.8,68.58 49.85,68.58 48.69,67.42 IC1.4
PE3
  Top 0.254: IC1.5 47.88,67.57 JP12.7
PE4
  Top 0.254: IC1.6 47.09,67.53 46.35,68.26 46.35,71.12 JP12.4
PE5
  Top 0.254: IC1.7 46.28,67.38 45.09,68.58 JP12.3
PE6
  Top 0.254: IC1.8 45.48,67.23 43.81,68.9 43.81,71.12 JP12.2
PE7
  Top 0.254: IC1.9 44.69,67.08 42.55,69.22 JP12.1
PF0
  Top 0.254: IC1.61 54.4,53.77 57.47,56.83 57.47,65.41 60.33,68.26 71.75,68.26 72.39,68.9 72.39,71.12 JP7.10
PF1
  Top 0.254: IC1.60 54.55,52.97 58.1,56.52 58.1,65.09 60.64,67.63 72.07,67.63 73.66,69.22 JP7.9
PF2  (via drill 0.6)
  Top 0.254: IC1.59 54.7,52.16 58.74,56.2 58.74,64.77 60.96,66.99 69.53,66.99 v69.85,66.67
  Bottom 0.254: v69.85,66.67 69.85,71.12 JP7.8
PF3  (via drill 0.6)
  Top 0.254: IC1.58 54.86,51.37 59.37,55.88 59.37,64.45 61.28,66.36 68.9,66.36 69.53,65.72 70.17,65.72 v71.12,66.67
  Bottom 0.254: v71.12,66.67 JP7.7
PF4  (via drill 0.6)
  Top 0.254: IC1.57 55.01,50.56 60.01,55.56 60.01,64.14 61.59,65.72 66.99,65.72 v67.31,65.41
  Bottom 0.254: v67.31,65.41 67.31,71.12 JP7.4
PF5  (via drill 0.6)
  Top 0.254: IC1.56 55.16,49.77 60.64,55.24 60.64,63.82 61.91,65.09 65.72,65.09 v66.04,64.77
  Bottom 0.254: 66.04,69.53 JP7.3 v66.04,64.77
PF6  (via drill 0.6)
  Top 0.254: IC1.55 55.31,48.97 61.28,54.93 61.28,63.18 v62.23,64.14
  Bottom 0.254: v62.23,64.14 62.23,71.12 JP7.2
PF7  (via drill 0.6)
  Top 0.254: IC1.54 55.47,48.16 61.91,54.61 61.91,62.55 v63.5,64.14
  Bottom 0.254: v63.5,64.14 JP7.1
PG0  (via drill 0.6)
  Top 0.254: R12.2 16.82,43.97 LED4.C 20.48,43.81 v22.23,43.81 | IC1.33 39.09,41.62 v38.1,40.64
  Bottom 0.254: v38.1,40.64 25.4,40.64 v22.23,43.81
PG1  (via drill 0.6)
  Top 0.254: R13.2 16.82,35.72 LED5.C 20.48,35.56 v22.23,35.56 | IC1.34 39.88,41.16 v39.37,40.64
  Bottom 0.254: v39.37,40.64 34.29,35.56 v22.23,35.56
PG2  (via drill 0.6)
  Top 0.254: R26.1 v15.88,29.84 | v48.26,44.45 47.09,43.27 IC1.43
  Bottom 0.254: v15.88,29.84 15.88,29.21 19.68,25.4 33.02,25.4 46.99,39.37 46.99,43.18 v48.26,44.45
PG3  (via drill 0.6)
  Top 0.254: IC1.18 39.88,55.37 v42.23,53.02 | v35.24,45.72 33.66,44.13 33.66,39.37 29.21,34.92 JP4.3
  Bottom 0.254: v42.23,53.02 42.23,50.16 37.78,45.72 v35.24,45.72
PG4  (via drill 0.6)
  Top 0.254: IC1.19 38.78,54.56 v43.18,50.16 | v36.2,43.18 35.56,42.55 35.56,37.47 33.02,34.92 33.02,29.21 JP4.2
  Bottom 0.254: v36.2,43.18 v43.18,50.16
REG_V  (via drill 0.6)
  Bottom 1.016: 59.05,25.4 59.05,8.26 54.61,3.81 JP10.3
  other vias: 63.5,32.38 64.77,32.38 65.41,33.66 64.14,33.66 62.87,33.66 60.33,33.66 60.33,32.38 60.33,34.92 63.5,34.92 64.77,34.92 67.94,36.2 60.33,36.2 67.94,31.11 60.33,31.11 67.94,32.38 67.94,33.66 67.94,34.92
  pour Top (no thermals): 77.47,22.23 77.47,47.62 64.77,47.62 64.77,43.18 49.53,43.18 49.53,22.23
  pour Bottom (no thermals): 50.16,45.09 50.16,21.59 77.47,21.59 77.47,45.09
RESERVED_1
  Top 0.254: X3.4 85.41,44.77 85.41,59.37 X2.4
RESERVED_2  (via drill 0.6)
  Top 0.254: v92.71,62.23 92.39,61.91 92.39,58.42 92.39,47.31 X3.5
  Bottom 0.254: v92.71,62.23 X2.5
RESET  (via drill 0.6)
  Top 0.254: IC1.20 36.41,53.77 36.2,53.98 v36.2,59.37 | C16.1 C4.2 17.65,59.03 R1.1 17.95,58.74 17.95,59.21 17.78,59.37 17.78,60.96 | S1.4 14.08,69.53 14.92,69.53 17.15,67.31 D1.A 16.99,63.34 16.99,60.96 | 16.99,60.96 H7.5 | 16.99,60.96 17.78,60.96 | 17.78,60.96 v24.77,60.96
  Top 0.305: S1.4 S1.3
  Bottom 0.254: v36.2,59.37 34.61,60.96 v24.77,60.96
RX  (via drill 0.6)
  Top 0.254: v15.56,59.69 10.79,59.69 H7.4 8.26,59.69 JP5.TXO | JP12.10 53.98,71.12 53.98,69.22 52.07,67.31 50.8,67.31 50.28,66.8 IC1.2
  Bottom 0.254: v15.56,59.69 19.05,59.69 24.13,64.77 49.53,64.77 53.98,69.22 53.98,71.12 JP12.10
RXCAN  (via drill 0.6)  (1 unrouted)
  Top 0.254: IC1.31 v43.7,44.97 | v62.87,52.7 IC2.4
  Bottom 0.254: 52.83,52.7 v62.87,52.7 | v43.7,44.97 44.33,44.97 52.07,52.7 52.7,52.7
TX
  Top 0.254: JP12.9 52.7,69.22 51.44,67.94 50.16,67.94 49.48,67.27 IC1.3
  Bottom 0.254: JP5.RXI 3.17,62.23 8.26,57.15 10.79,57.15 H7.1 13.34,57.15 13.34,62.23 12.7,62.87 12.7,64.14 13.97,65.41 48.9,65.41 52.7,69.22 JP12.9
TXCAN  (via drill 0.6)
  Top 0.254: IC1.30 v42.59,45.77 | v62.87,56.52 IC2.1
  Bottom 0.254: v42.59,45.77 44.18,45.77 51.75,53.34 59.05,53.34 62.23,56.52 v62.87,56.52 62.5,56.52
USB_V  (via drill 0.6)
  Top 1.016: v5.08,31.75 6.99,33.66 F10.1
  Bottom 1.016: v5.08,31.75 5.08,8.26 11.75,1.59 43.81,1.59 JP10.1
VCC
  pour Top (rank 6): 5.71,0 5.71,3.81 3.81,5.71 0,5.71 0,70.48 3.81,70.48 5.71,72.39 5.71,76.2 93.98,76.2 93.98,72.39 95.89,70.48 99.69,70.48 99.69,5.71 95.89,5.71 93.98,3.81 93.98,0
  pour Top: 46.99,1.91 50.16,1.91 50.16,5.71 46.99,5.71
VIN
  Top 1.016: D2.C 81.21,44.13 78.74,44.13 | 78.74,44.13 72.07,44.13 67.94,48.26 JP2.2 | 78.74,44.13 78.74,34.73 C15.+ 73.75,34.29 IC5.3
XTAL1  (1 unrouted)
  Top 0.254: C2.2 29.71,53.84 31.75,55.88 36.27,51.37 IC1.23

### Text on the board
tPlace: 6 | 0 | 6 | 0 | 6 | 0 | 7 | 1 | 7 | 1 | 7 | 1 | RESET | TERMINATION | FTDI | PORT B | PORT E | PORT F | GRN | BLK | CAN OUT | BLUE | CAN PWR | CAN IN | GOLD | NodeID: | 05.02.01.02.02. | 1 | 7 | 0 | 6 | v1.0 | PORT D/G | + | 7 | 6 | 5 | 4 | 3 | 2 | 1 | 0 | - | 9-12VDC | NMRAnet S-9.7 | USB PWR | INPUTS | EXT | OUTPUTS | +5V | GND | +5V | GND | 7 | 6 | 5 | 4 | 3 | 2 | 1 | 0 | USB | 7 | 6 | 5 | 4 | 3 | 2 | 1 | 0 | Copyright (C) 2011 D.E. Goodman-Wilson | Licensed under CERN OHL v.1.1 | http://ohwr.org/cernohl
bPlace: 300 | 300 | v1.0 | http://railstars.com/hardware/io | Licensed under CERN OHL v.1.1 | INPUTS | OUTPUTS | http://ohwr.org/cernohl | +5V | GND | +5V | GND | 20111223 | 7 | 6 | 5 | 4 | 3 | 2 | 1 | 0 | 7 | 6 | 5 | 4 | 3 | 2 | 1 | 0